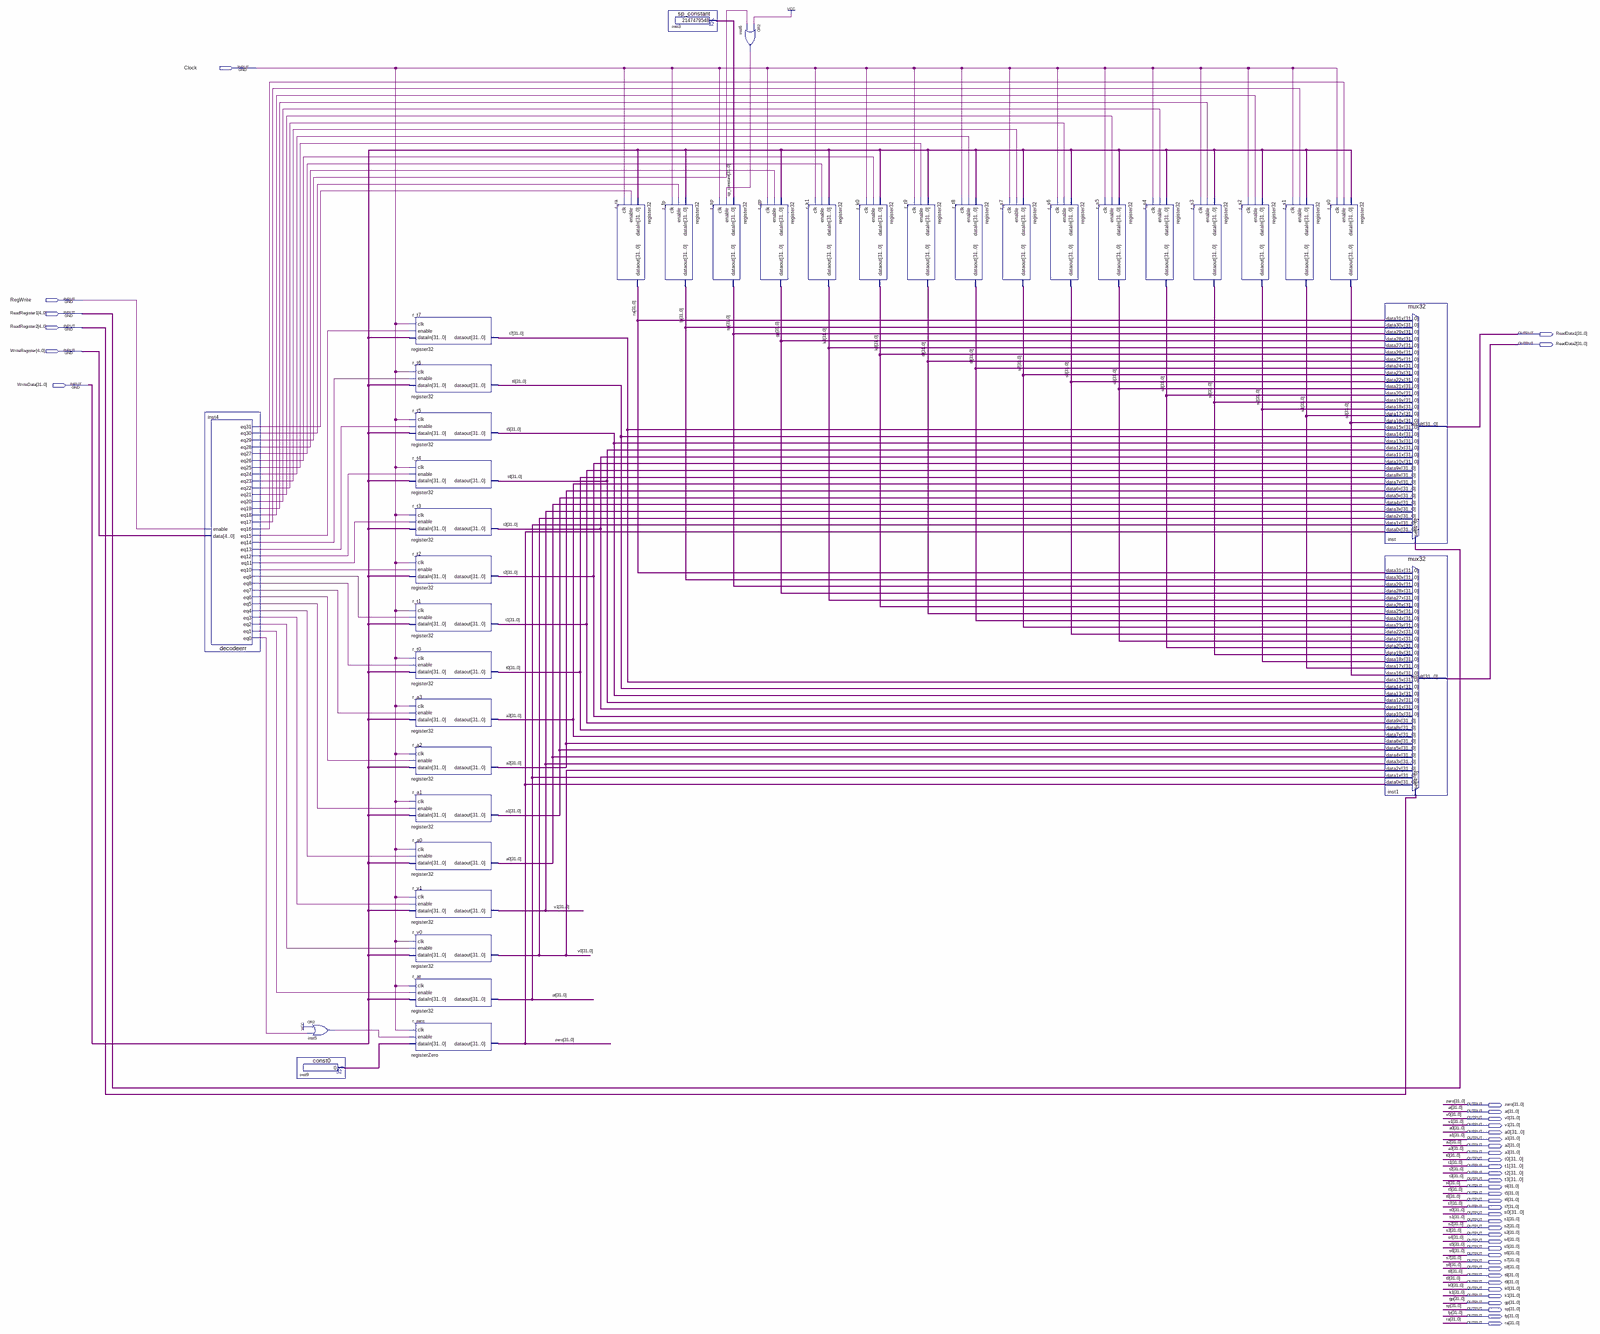
[diagram p0: schematic sheet, whole]
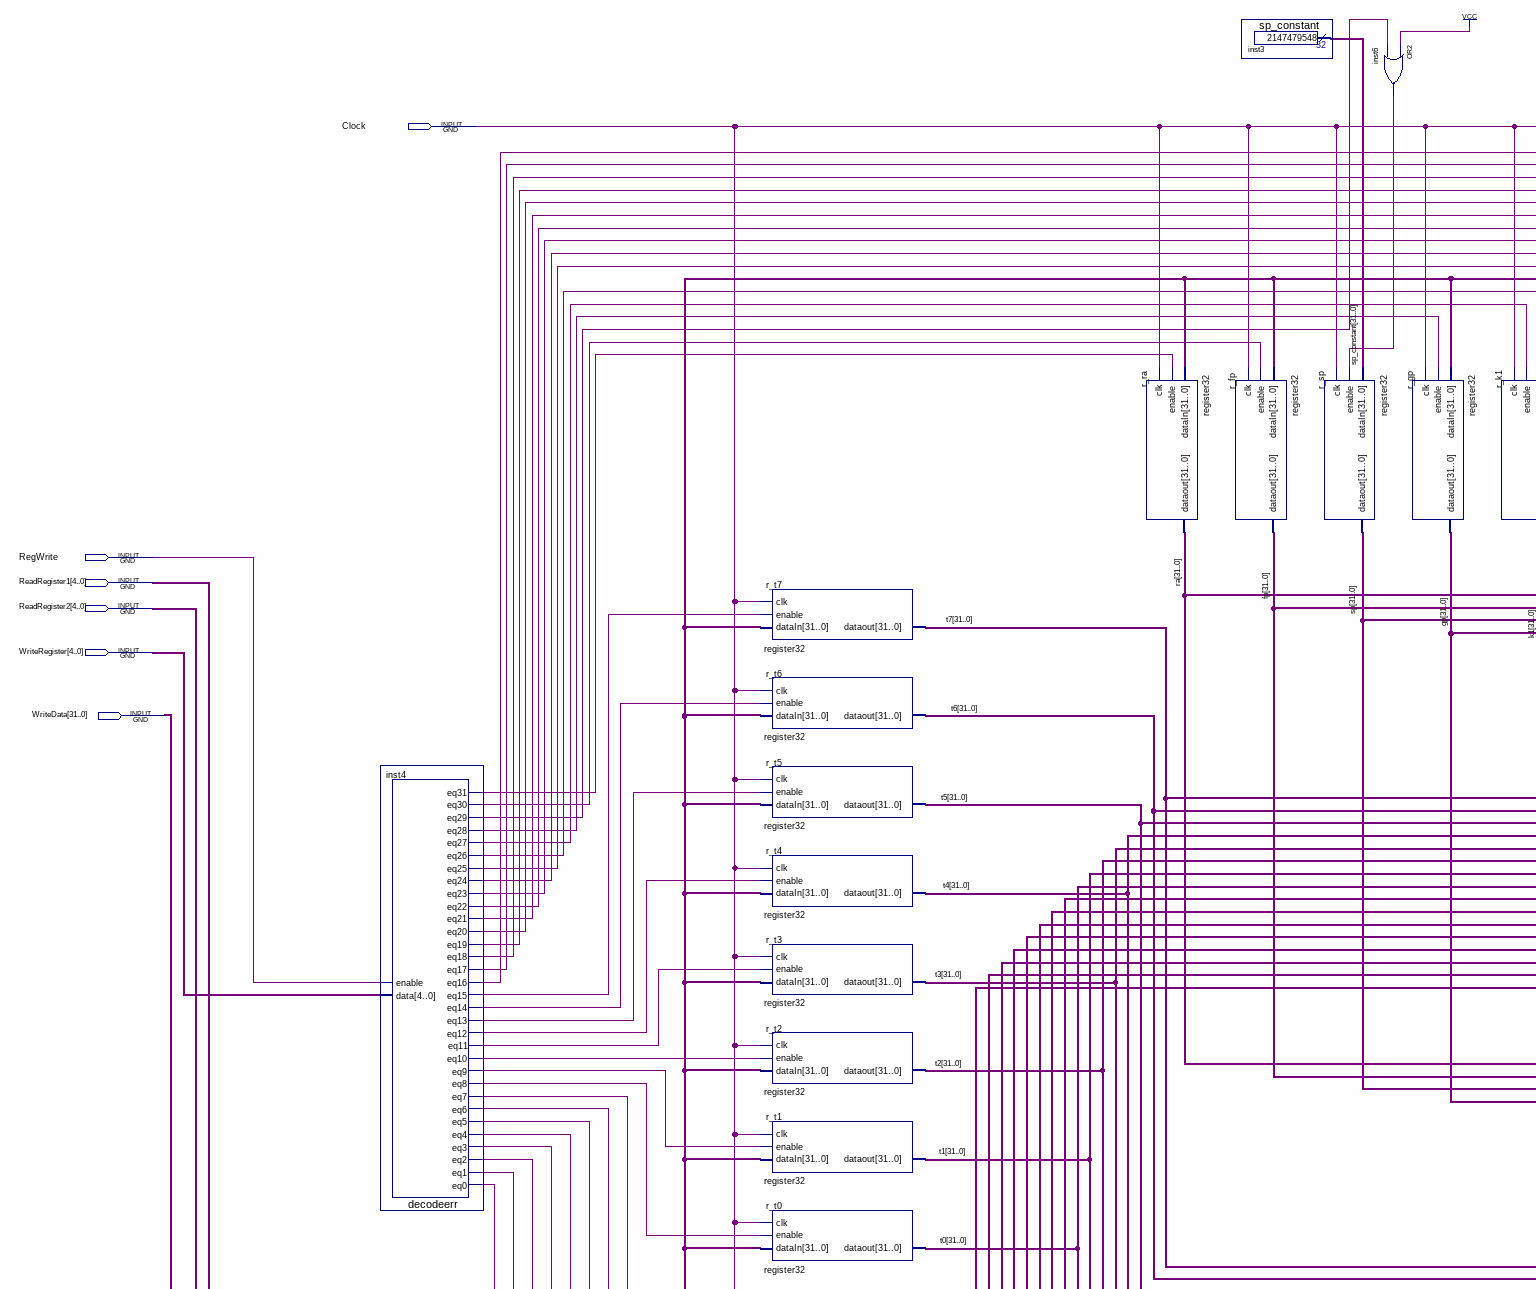
[diagram p1: schematic sheet, upper left part]
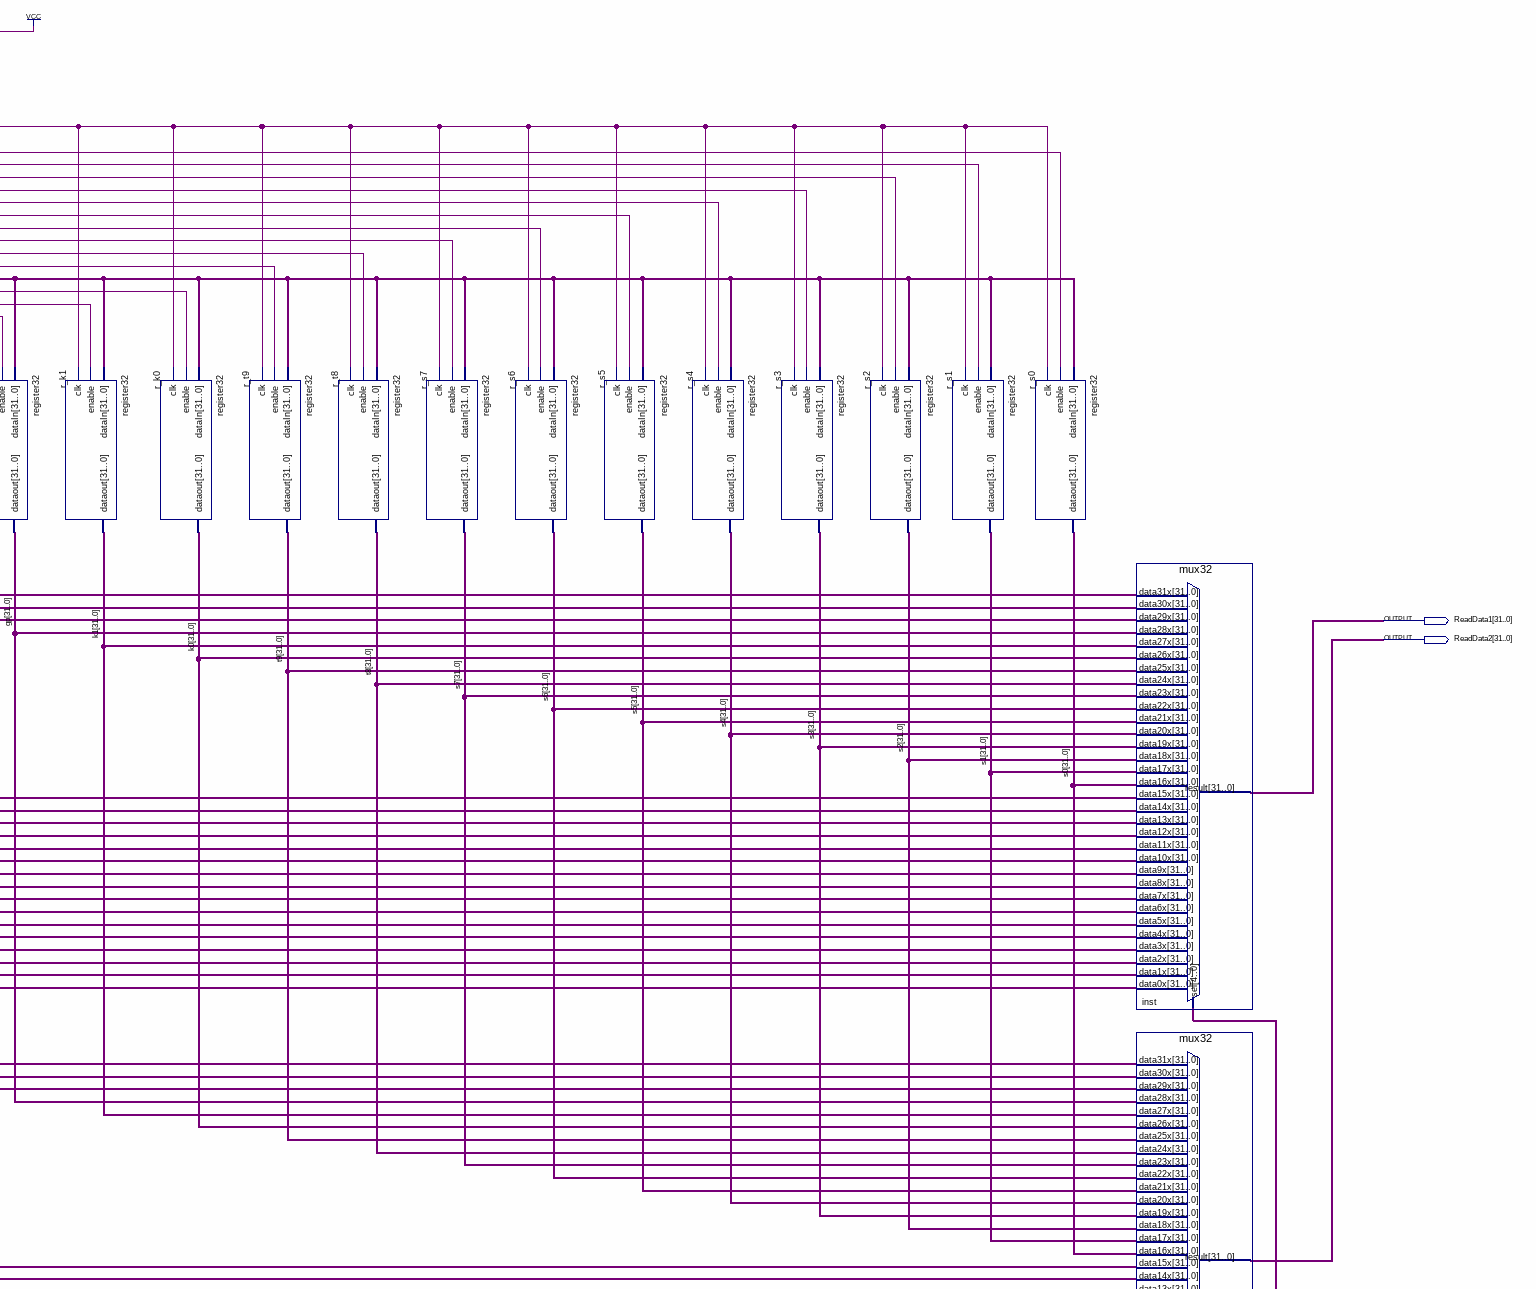
[diagram p2: schematic sheet, upper right part]
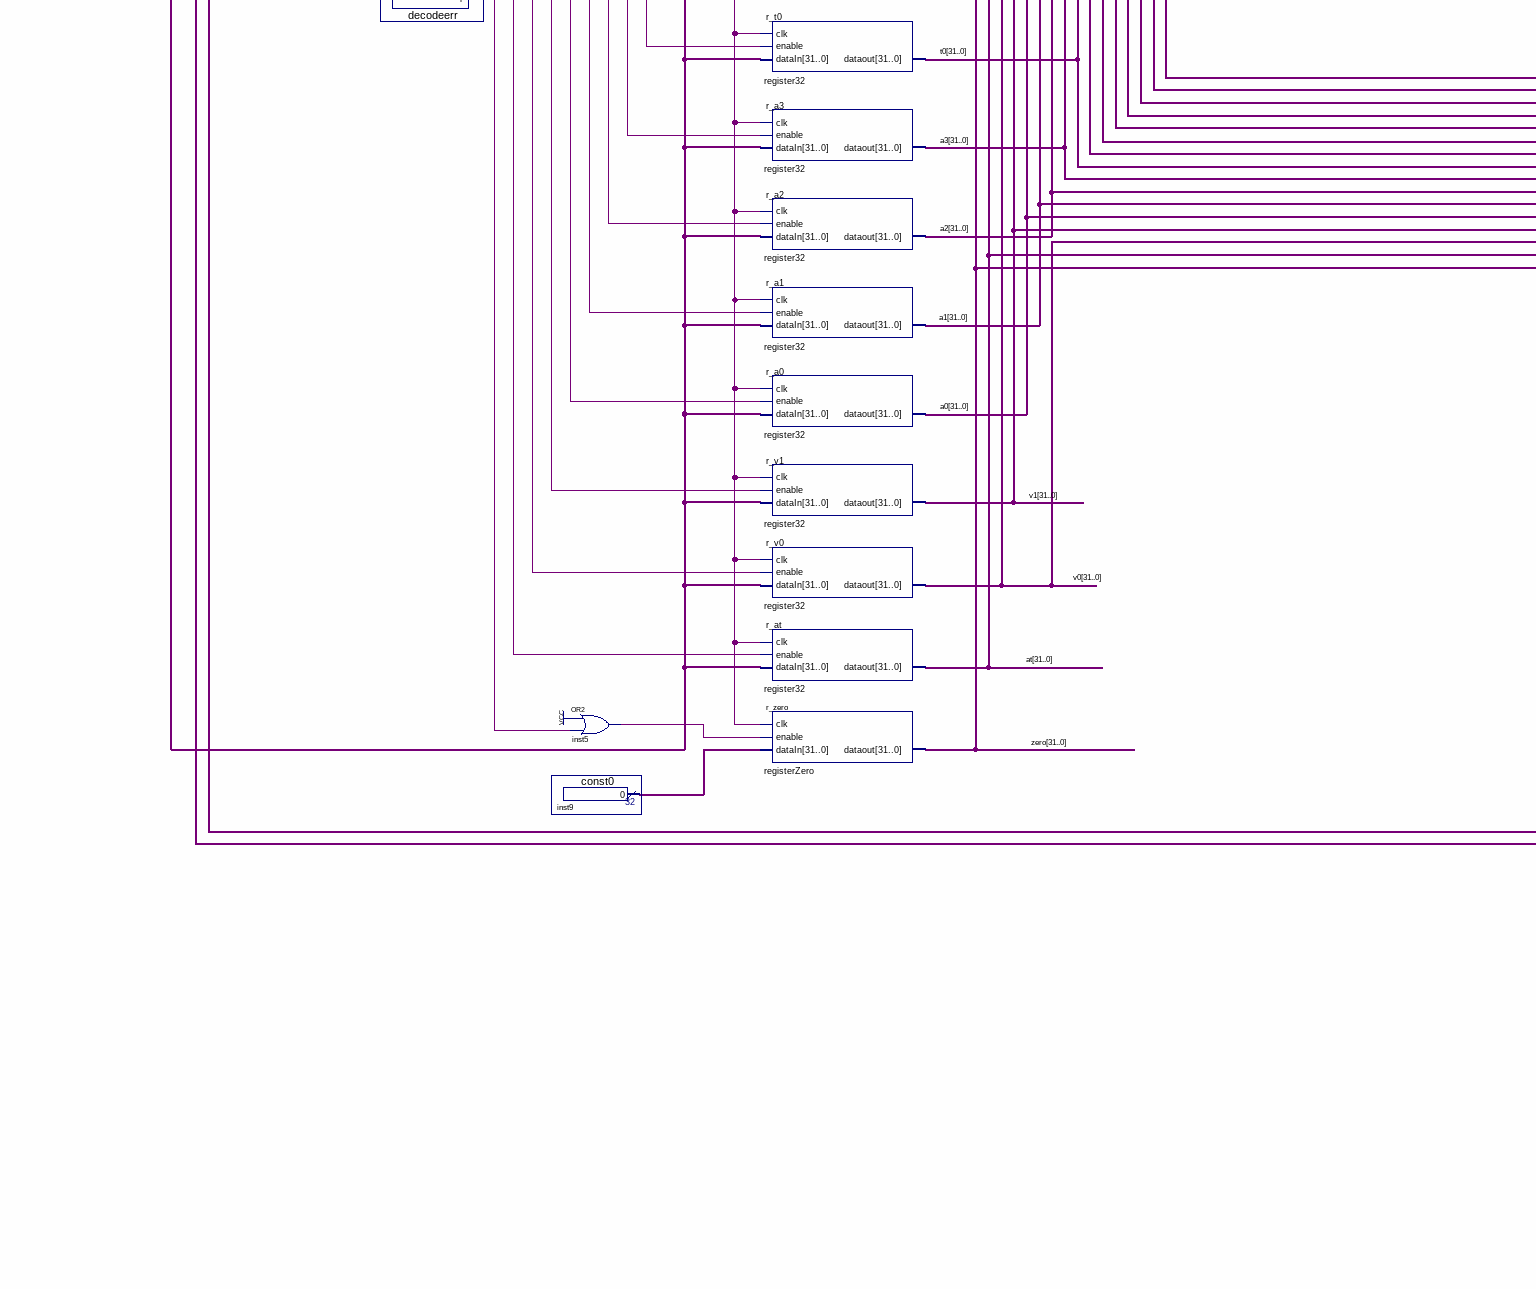
[diagram p3: schematic sheet, lower left part]
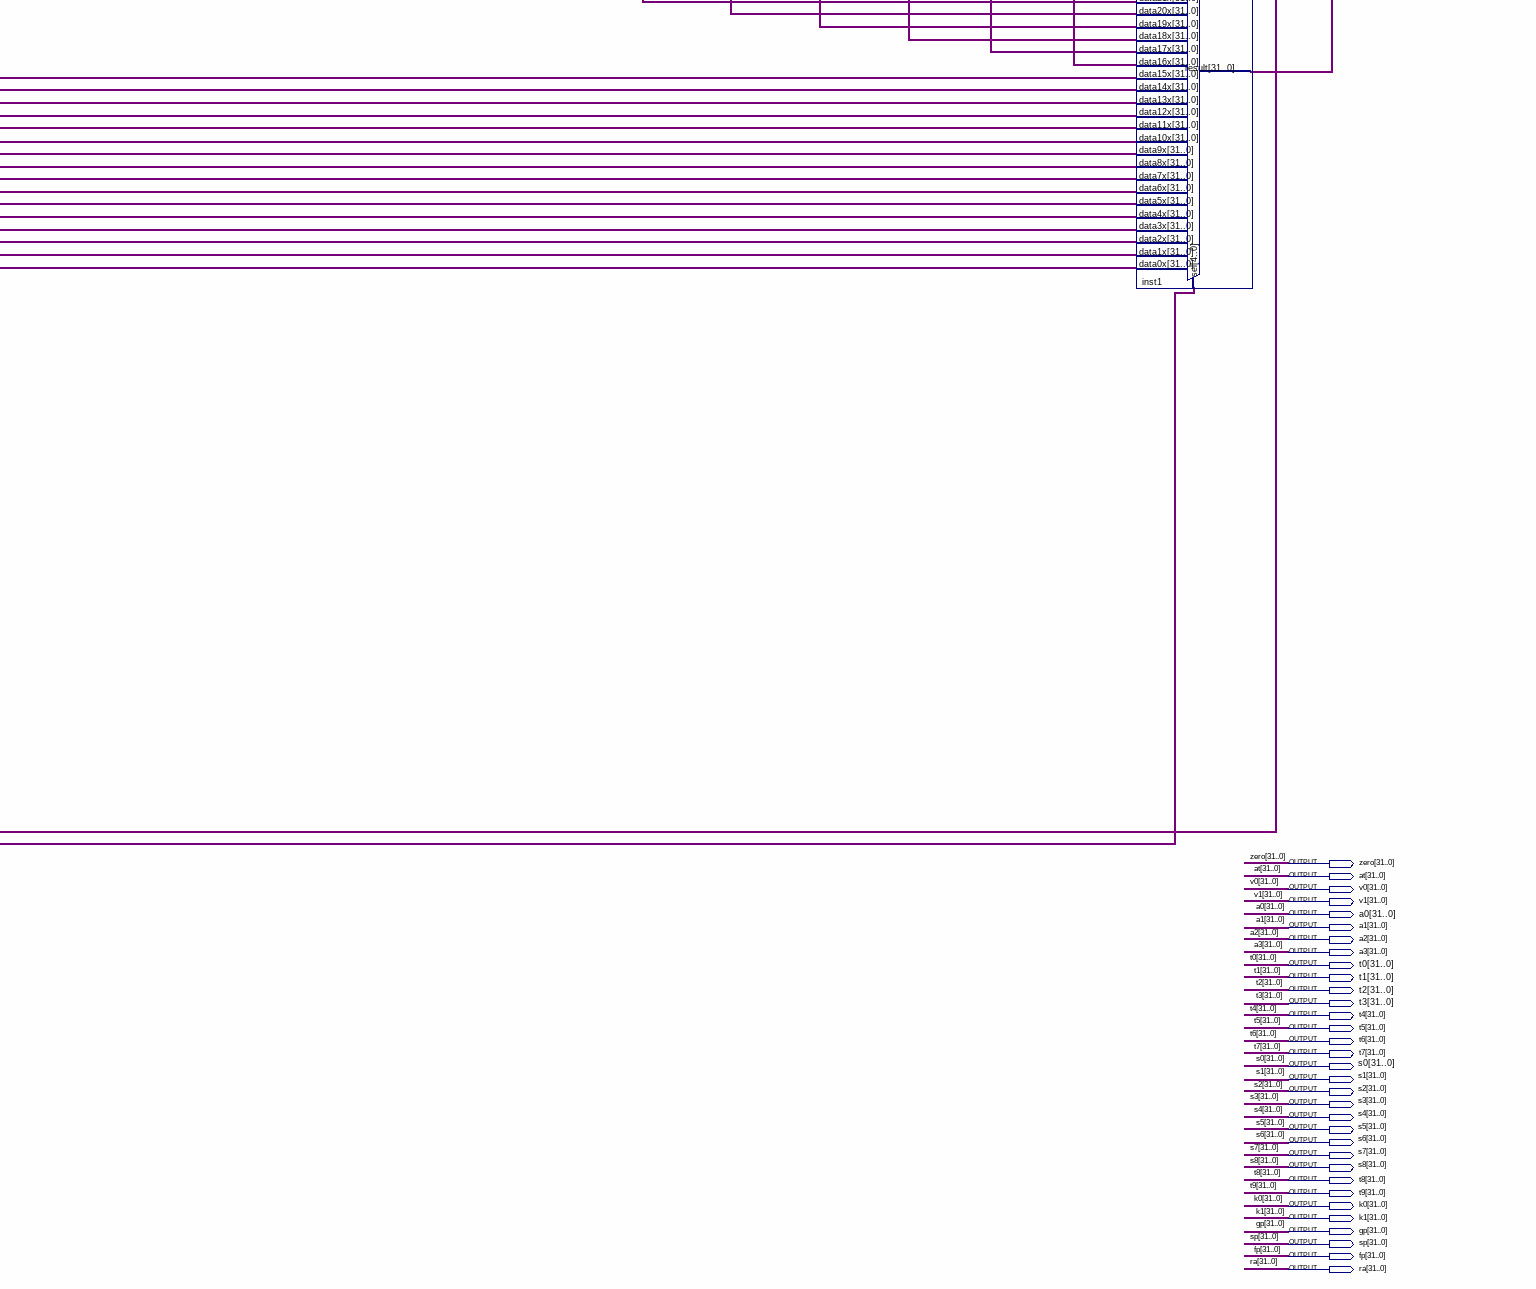
[diagram p4: schematic sheet, lower right part]
// Quartus schematic registerFile.bdf as structural Verilog: 39 symbols, 41 pins
module registerFile (
  input  Clock,
  input  RegWrite,
  input  [4:0] ReadRegister1,
  input  [4:0] ReadRegister2,
  input  [4:0] WriteRegister,
  input  [31:0] WriteData,
  output [31:0] ReadData1,
  output [31:0] ReadData2,
  output [31:0] zero,
  output [31:0] at,
  output [31:0] v0,
  output [31:0] v1,
  output [31:0] a0,
  output [31:0] a1,
  output [31:0] a2,
  output [31:0] a3,
  output [31:0] t0,
  output [31:0] t1,
  output [31:0] t2,
  output [31:0] t3,
  output [31:0] t4,
  output [31:0] t5,
  output [31:0] t6,
  output [31:0] t7,
  output [31:0] s0,
  output [31:0] s1,
  output [31:0] s2,
  output [31:0] s3,
  output [31:0] s4,
  output [31:0] s5,
  output [31:0] s6,
  output [31:0] s7,
  output [31:0] s8,
  output [31:0] t8,
  output [31:0] t9,
  output [31:0] k0,
  output [31:0] k1,
  output [31:0] gp,
  output [31:0] sp,
  output [31:0] fp,
  output [31:0] ra
);

  wire inst4_eq0, inst4_eq1, inst4_eq2, inst4_eq3, inst4_eq4, inst4_eq5, inst4_eq6, inst4_eq7, inst4_eq8,
       inst4_eq9, inst4_eq10, inst4_eq11, inst4_eq12, inst4_eq13, inst4_eq14, inst4_eq15, inst4_eq16,
       inst4_eq17, inst4_eq18, inst4_eq19, inst4_eq20, inst4_eq21, inst4_eq22, inst4_eq23, inst4_eq24,
       inst4_eq25, inst4_eq26, inst4_eq27, inst4_eq28, inst4_eq29, inst4_eq30, inst4_eq31, inst5_out,
       inst6_out;
  wire [31:0] inst9_result, sp_constant;

  decodeerr inst4 (
    .data(WriteRegister), .enable(RegWrite), .eq0(inst4_eq0), .eq1(inst4_eq1), .eq2(inst4_eq2),
    .eq3(inst4_eq3), .eq4(inst4_eq4), .eq5(inst4_eq5), .eq6(inst4_eq6), .eq7(inst4_eq7), .eq8(inst4_eq8),
    .eq9(inst4_eq9), .eq10(inst4_eq10), .eq11(inst4_eq11), .eq12(inst4_eq12), .eq13(inst4_eq13),
    .eq14(inst4_eq14), .eq15(inst4_eq15), .eq16(inst4_eq16), .eq17(inst4_eq17), .eq18(inst4_eq18),
    .eq19(inst4_eq19), .eq20(inst4_eq20), .eq21(inst4_eq21), .eq22(inst4_eq22), .eq23(inst4_eq23),
    .eq24(inst4_eq24), .eq25(inst4_eq25), .eq26(inst4_eq26), .eq27(inst4_eq27), .eq28(inst4_eq28),
    .eq29(inst4_eq29), .eq30(inst4_eq30), .eq31(inst4_eq31));
  or inst5 (inst5_out, 1'b1, inst4_eq0);
  const0 inst9 (.result(inst9_result));
  register32 r_t7 (.dataIn(WriteData), .enable(inst4_eq15), .clk(Clock), .dataout(t7));
  register32 r_t6 (.dataIn(WriteData), .enable(inst4_eq14), .clk(Clock), .dataout(t6));
  register32 r_t5 (.dataIn(WriteData), .enable(inst4_eq13), .clk(Clock), .dataout(t5));
  register32 r_t4 (.dataIn(WriteData), .enable(inst4_eq12), .clk(Clock), .dataout(t4));
  register32 r_t3 (.dataIn(WriteData), .enable(inst4_eq11), .clk(Clock), .dataout(t3));
  register32 r_t2 (.dataIn(WriteData), .enable(inst4_eq10), .clk(Clock), .dataout(t2));
  register32 r_t1 (.dataIn(WriteData), .enable(inst4_eq9), .clk(Clock), .dataout(t1));
  register32 r_t0 (.dataIn(WriteData), .enable(inst4_eq8), .clk(Clock), .dataout(t0));
  register32 r_a3 (.dataIn(WriteData), .enable(inst4_eq7), .clk(Clock), .dataout(a3));
  register32 r_a2 (.dataIn(WriteData), .enable(inst4_eq6), .clk(Clock), .dataout(a2));
  register32 r_a1 (.dataIn(WriteData), .enable(inst4_eq5), .clk(Clock), .dataout(a1));
  register32 r_a0 (.dataIn(WriteData), .enable(inst4_eq4), .clk(Clock), .dataout(a0));
  register32 r_v1 (.dataIn(WriteData), .enable(inst4_eq3), .clk(Clock), .dataout(v1));
  register32 r_v0 (.dataIn(WriteData), .enable(inst4_eq2), .clk(Clock), .dataout(v0));
  register32 r_at (.dataIn(WriteData), .enable(inst4_eq1), .clk(Clock), .dataout(at));
  registerZero r_zero (.dataIn(inst9_result), .enable(inst5_out), .clk(Clock), .dataout(zero));
  register32 r_ra (.dataIn(WriteData), .enable(inst4_eq31), .clk(Clock), .dataout(ra));
  sp_constant inst3 (.result(sp_constant));
  register32 r_fp (.dataIn(WriteData), .enable(inst4_eq30), .clk(Clock), .dataout(fp));
  register32 r_sp (.dataIn(sp_constant), .enable(inst6_out), .clk(Clock), .dataout(sp));
  or inst6 (inst6_out, 1'b1, inst4_eq29);
  register32 r_gp (.dataIn(WriteData), .enable(inst4_eq28), .clk(Clock), .dataout(gp));
  register32 r_k1 (.dataIn(WriteData), .enable(inst4_eq27), .clk(Clock), .dataout(k1));
  register32 r_k0 (.dataIn(WriteData), .enable(inst4_eq26), .clk(Clock), .dataout(k0));
  register32 r_t9 (.dataIn(WriteData), .enable(inst4_eq25), .clk(Clock), .dataout(t9));
  register32 r_t8 (.dataIn(WriteData), .enable(inst4_eq24), .clk(Clock), .dataout(t8));
  register32 r_s7 (.dataIn(WriteData), .enable(inst4_eq23), .clk(Clock), .dataout(s7));
  register32 r_s6 (.dataIn(WriteData), .enable(inst4_eq22), .clk(Clock), .dataout(s6));
  register32 r_s5 (.dataIn(WriteData), .enable(inst4_eq21), .clk(Clock), .dataout(s5));
  register32 r_s4 (.dataIn(WriteData), .enable(inst4_eq20), .clk(Clock), .dataout(s4));
  register32 r_s3 (.dataIn(WriteData), .enable(inst4_eq19), .clk(Clock), .dataout(s3));
  register32 r_s2 (.dataIn(WriteData), .enable(inst4_eq18), .clk(Clock), .dataout(s2));
  register32 r_s1 (.dataIn(WriteData), .enable(inst4_eq17), .clk(Clock), .dataout(s1));
  register32 r_s0 (.dataIn(WriteData), .enable(inst4_eq16), .clk(Clock), .dataout(s0));
  mux32 inst (
    .data31x(ra), .data30x(fp), .data29x(sp), .data28x(gp), .data27x(k1), .data26x(k0), .data25x(t9),
    .data24x(t8), .data23x(s7), .data22x(s6), .data21x(s5), .data20x(s4), .data19x(s3), .data18x(s2),
    .data17x(s1), .data16x(s0), .data15x(t7), .data14x(t6), .data13x(t5), .data12x(t4), .data11x(t3),
    .data10x(t2), .data9x(t1), .data8x(t0), .data7x(a3), .data6x(a2), .data5x(a1), .data4x(a0), .data3x(v1),
    .data2x(v0), .data1x(at), .data0x(zero), .sel(ReadRegister1), .result(ReadData1));
  mux32 inst1 (
    .data31x(ra), .data30x(fp), .data29x(sp), .data28x(gp), .data27x(k1), .data26x(k0), .data25x(t9),
    .data24x(t8), .data23x(s7), .data22x(s6), .data21x(s5), .data20x(s4), .data19x(s3), .data18x(s2),
    .data17x(s1), .data16x(s0), .data15x(t7), .data14x(t6), .data13x(t5), .data12x(t4), .data11x(t3),
    .data10x(t2), .data9x(t1), .data8x(t0), .data7x(a3), .data6x(a2), .data5x(a1), .data4x(a0), .data3x(v1),
    .data2x(v0), .data1x(at), .data0x(zero), .sel(ReadRegister2), .result(ReadData2));
endmodule
